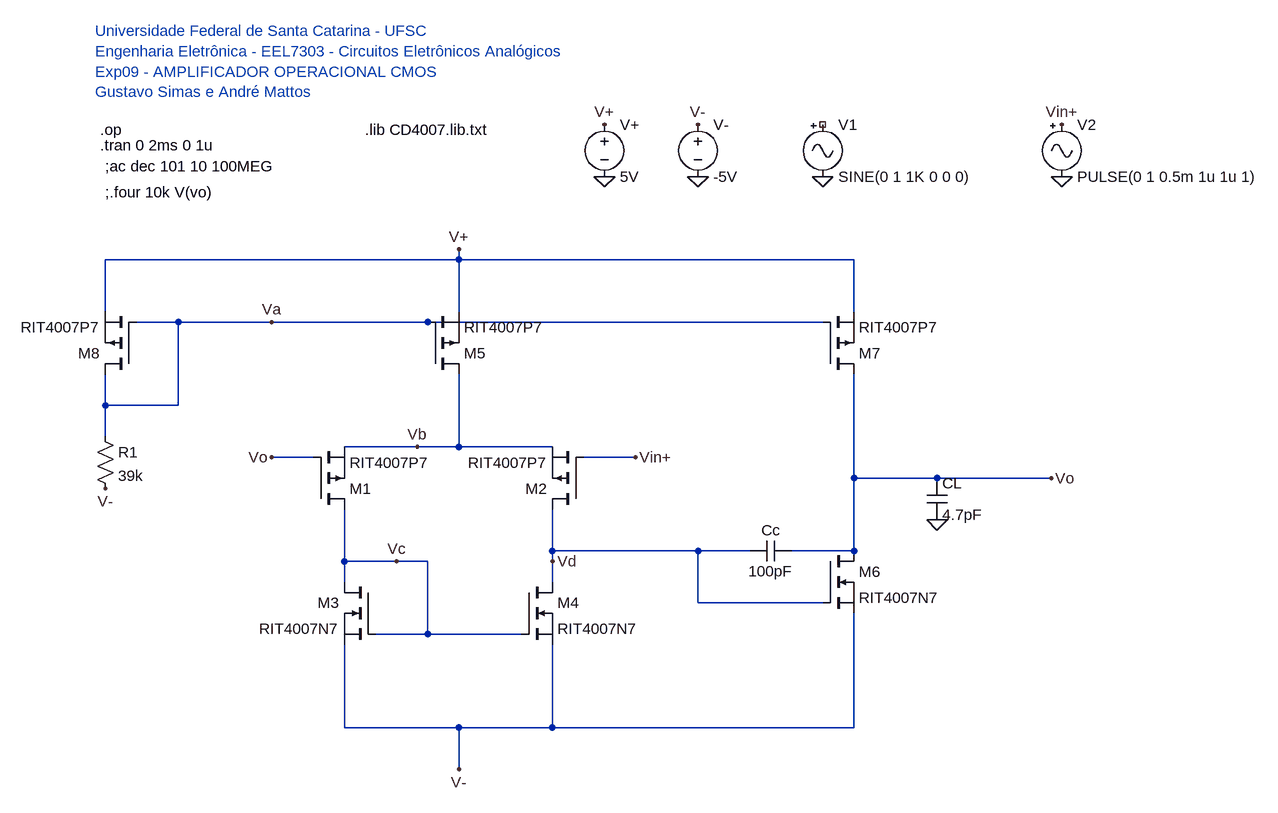
[diagram p0: schematic Lab09.asc]
Lab09.asc, the LTspice schematic file:
Version 4
SHEET 1 2908 1256
WIRE 480 384 480 368
WIRE 480 384 -64 384
WIRE 1088 384 480 384
WIRE -64 464 -64 384
WIRE 480 464 480 384
WIRE 1088 464 1088 384
WIRE 48 480 -16 480
WIRE 192 480 48 480
WIRE 432 480 192 480
WIRE 1040 480 432 480
WIRE -64 608 -64 560
WIRE 48 608 48 480
WIRE 48 608 -64 608
WIRE -64 656 -64 608
WIRE 416 672 304 672
WIRE 480 672 480 560
WIRE 480 672 416 672
WIRE 624 672 480 672
WIRE 256 688 192 688
WIRE 752 688 672 688
WIRE 1088 720 1088 560
WIRE 1216 720 1088 720
WIRE 1392 720 1216 720
WIRE 624 832 624 768
WIRE 848 832 624 832
WIRE 928 832 848 832
WIRE 1088 832 1088 720
WIRE 1088 832 992 832
WIRE 304 848 304 768
WIRE 384 848 304 848
WIRE 432 848 384 848
WIRE 624 848 624 832
WIRE 304 880 304 848
WIRE 624 880 624 848
WIRE 848 912 848 832
WIRE 1040 912 848 912
WIRE 432 960 432 848
WIRE 432 960 352 960
WIRE 576 960 432 960
WIRE 304 1104 304 976
WIRE 480 1104 304 1104
WIRE 624 1104 624 976
WIRE 624 1104 480 1104
WIRE 1088 1104 1088 928
WIRE 1088 1104 624 1104
WIRE 480 1168 480 1104
FLAG 704 256 0
FLAG 704 176 V+
FLAG 848 256 0
FLAG 848 176 V-
FLAG -64 736 V-
FLAG 480 368 V+
FLAG 192 688 Vo
FLAG 480 1168 V-
FLAG 1216 784 0
FLAG 1392 720 Vo
FLAG 1040 256 0
FLAG 192 480 Va
FLAG 416 672 Vb
FLAG 384 848 Vc
FLAG 624 848 Vd
FLAG 752 688 Vin+
FLAG 1408 256 0
FLAG 1408 176 Vin+
DATAFLAG 80 480 ""
DATAFLAG 336 672 ""
SYMBOL res -80 640 R0
SYMATTR InstName R1
SYMATTR Value 39k
SYMBOL voltage 704 160 R0
WINDOW 123 0 0 Left 0
WINDOW 39 0 0 Left 0
SYMATTR InstName V+
SYMATTR Value 5V
SYMBOL voltage 848 160 R0
WINDOW 123 0 0 Left 0
WINDOW 39 0 0 Left 0
SYMATTR InstName V-
SYMATTR Value -5V
SYMBOL nmos 576 880 R0
SYMATTR InstName M4
SYMATTR Value RIT4007N7
SYMBOL pmos -16 560 R180
SYMATTR InstName M8
SYMATTR Value RIT4007P7
SYMBOL pmos 1040 560 M180
SYMATTR InstName M7
SYMATTR Value RIT4007P7
SYMBOL pmos 432 560 M180
SYMATTR InstName M5
SYMATTR Value RIT4007P7
SYMBOL pmos 256 768 M180
SYMATTR InstName M1
SYMATTR Value RIT4007P7
SYMBOL pmos 672 768 R180
SYMATTR InstName M2
SYMATTR Value RIT4007P7
SYMBOL nmos 352 880 M0
SYMATTR InstName M3
SYMATTR Value RIT4007N7
SYMBOL nmos 1040 832 R0
SYMATTR InstName M6
SYMATTR Value RIT4007N7
SYMBOL cap 992 816 R90
WINDOW 0 0 32 VBottom 2
WINDOW 3 32 32 VTop 2
SYMATTR InstName Cc
SYMATTR Value 100pF
SYMBOL cap 1200 720 R0
SYMATTR InstName CL
SYMATTR Value 4.7pF
SYMBOL Misc\\signal 1040 160 R0
WINDOW 123 24 132 Left 2
WINDOW 39 0 0 Left 0
SYMATTR InstName V1
SYMATTR Value SINE(0 1 1K 0 0 0)
SYMBOL Misc\\signal 1408 160 R0
WINDOW 123 24 132 Left 2
WINDOW 39 0 0 Left 0
SYMATTR InstName V2
SYMATTR Value PULSE(0 1 0.5m 1u 1u 1)
TEXT -80 32 Left 2 ;Universidade Federal de Santa Catarina - UFSC\nEngenharia Eletrônica - EEL7303 - Circuitos Eletrônicos Analógicos\nExp09 - AMPLIFICADOR OPERACIONAL CMOS\nGustavo Simas e André Mattos
TEXT -72 208 Left 2 !.tran 0 2ms 0 1u
TEXT -72 184 Left 2 !.op
TEXT -64 240 Left 2 !;ac dec 101 10 100MEG
TEXT -64 280 Left 2 !;.four 10k V(vo)
TEXT 336 184 Left 2 !.lib CD4007.lib.txt

The netlist it stands for:
* Lab09.asc
R1 Va V- 39k
V+ V+ 0 5V
V- V- 0 -5V
M4 Vd Vc V- V- RIT4007N7
M8 Va Va V+ V+ RIT4007P7
M7 Vo Va V+ V+ RIT4007P7
M5 Vb Va V+ V+ RIT4007P7
M1 Vc Vo Vb Vb RIT4007P7
M2 Vd Vin+ Vb Vb RIT4007P7
M3 Vc Vc V- V- RIT4007N7
M6 Vo Vd V- V- RIT4007N7
Cc Vo Vd 100pF
CL Vo 0 4.7pF
V1 NC_01 0 SINE(0 1 1K 0 0 0)
V2 Vin+ 0 PULSE(0 1 0.5m 1u 1u 1)
.model NMOS NMOS
.model PMOS PMOS
.lib standard.mos
* Universidade Federal de Santa Catarina - UFSC
* Engenharia Eletrônica - EEL7303 - Circuitos Eletrônicos Analógicos
* Exp09 - AMPLIFICADOR OPERACIONAL CMOS
* Gustavo Simas e André Mattos
.tran 0 2ms 0 1u
.op
;ac dec 101 10 100MEG
;.four 10k V(vo)
.lib CD4007.lib.txt
.backanno
.end